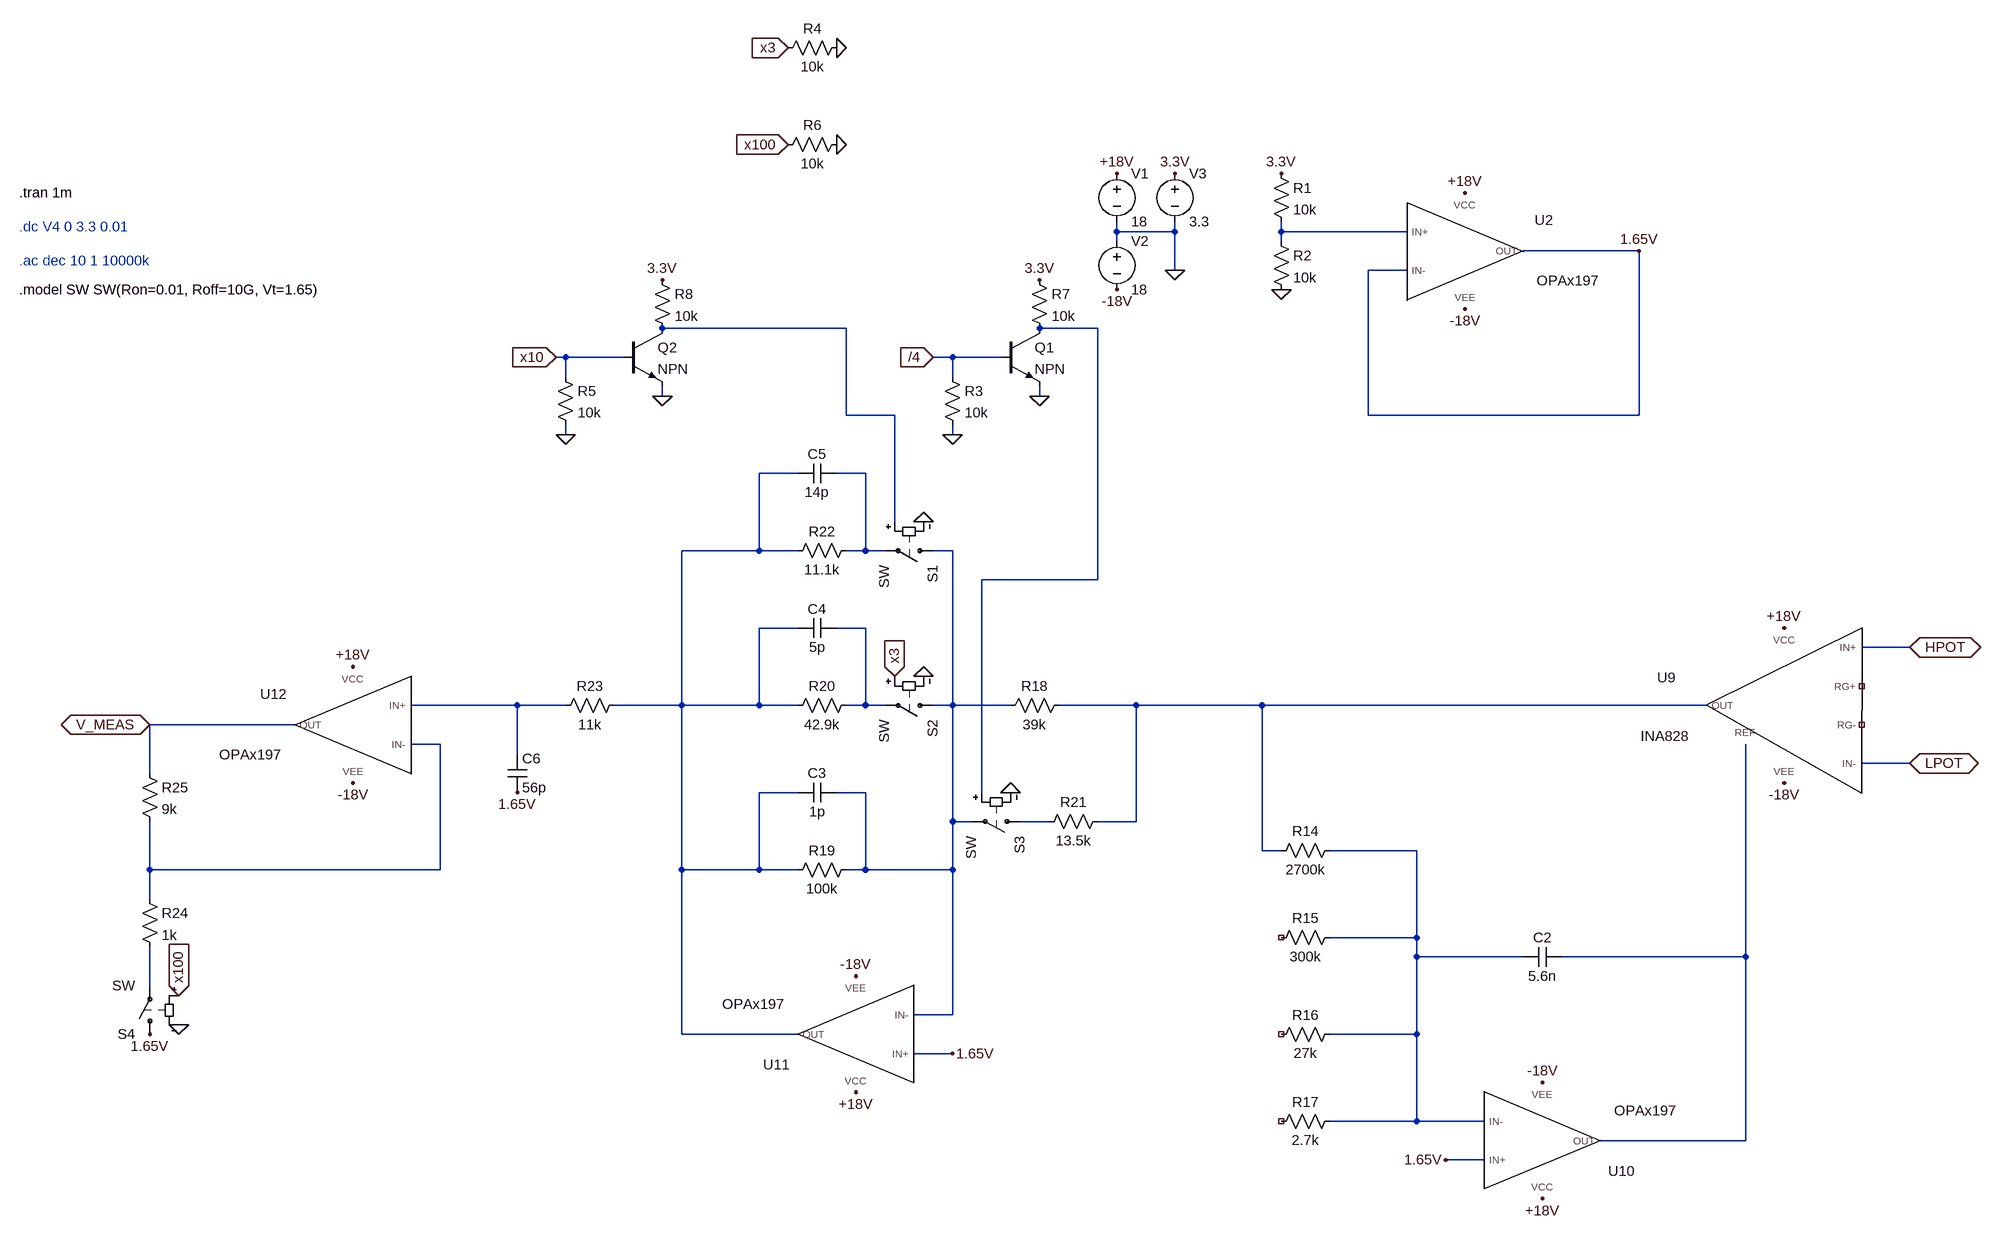
[diagram p0: schematic Vamp.asc]
Vamp.asc, the LTspice schematic file:
Version 4.1
SHEET 1 2076 5472
WIRE -16 1648 -16 1632
WIRE 80 1648 80 1632
WIRE 80 1648 -16 1648
WIRE 256 1648 256 1632
WIRE 464 1648 256 1648
WIRE -16 1664 -16 1648
WIRE 256 1664 256 1648
WIRE 848 1680 656 1680
WIRE 80 1712 80 1648
WIRE 464 1712 400 1712
WIRE -464 1808 -768 1808
WIRE -48 1808 -144 1808
WIRE -928 1856 -944 1856
WIRE -832 1856 -928 1856
WIRE -288 1856 -320 1856
WIRE -208 1856 -288 1856
WIRE -928 1888 -928 1856
WIRE -288 1888 -288 1856
WIRE -768 1920 -768 1904
WIRE -144 1920 -144 1904
WIRE -464 1952 -464 1808
WIRE -384 1952 -464 1952
WIRE 400 1952 400 1712
WIRE 848 1952 848 1680
WIRE 848 1952 400 1952
WIRE -928 1984 -928 1968
WIRE -288 1984 -288 1968
WIRE -544 2048 -608 2048
WIRE -432 2048 -480 2048
WIRE -384 2128 -384 1952
WIRE -608 2176 -608 2048
WIRE -608 2176 -736 2176
WIRE -544 2176 -608 2176
WIRE -432 2176 -432 2048
WIRE -432 2176 -464 2176
WIRE -400 2176 -432 2176
WIRE -288 2176 -320 2176
WIRE -48 2224 -48 1808
WIRE -48 2224 -240 2224
WIRE -544 2304 -608 2304
WIRE -432 2304 -480 2304
WIRE 1296 2336 1216 2336
WIRE -1008 2432 -1184 2432
WIRE -928 2432 -1008 2432
WIRE -736 2432 -736 2176
WIRE -736 2432 -848 2432
WIRE -608 2432 -608 2304
WIRE -608 2432 -736 2432
WIRE -544 2432 -608 2432
WIRE -432 2432 -432 2304
WIRE -432 2432 -464 2432
WIRE -400 2432 -432 2432
WIRE -288 2432 -288 2176
WIRE -288 2432 -320 2432
WIRE -192 2432 -288 2432
WIRE 16 2432 -112 2432
WIRE 224 2432 16 2432
WIRE 960 2432 224 2432
WIRE -1376 2464 -1616 2464
WIRE -1136 2496 -1184 2496
WIRE -1008 2512 -1008 2432
WIRE 1296 2528 1216 2528
WIRE -1616 2544 -1616 2464
WIRE -544 2576 -608 2576
WIRE -432 2576 -480 2576
WIRE -240 2576 -240 2224
WIRE -288 2624 -288 2432
WIRE -256 2624 -288 2624
WIRE -128 2624 -176 2624
WIRE 16 2624 16 2432
WIRE 16 2624 -48 2624
WIRE 224 2672 224 2432
WIRE 256 2672 224 2672
WIRE 480 2672 336 2672
WIRE -1616 2704 -1616 2624
WIRE -1136 2704 -1136 2496
WIRE -1136 2704 -1616 2704
WIRE -736 2704 -736 2432
WIRE -608 2704 -608 2576
WIRE -608 2704 -736 2704
WIRE -544 2704 -608 2704
WIRE -432 2704 -432 2576
WIRE -432 2704 -464 2704
WIRE -288 2704 -288 2624
WIRE -288 2704 -432 2704
WIRE -1616 2752 -1616 2704
WIRE 480 2816 480 2672
WIRE 480 2816 336 2816
WIRE 480 2848 480 2816
WIRE 656 2848 480 2848
WIRE 1024 2848 1024 2496
WIRE 1024 2848 720 2848
WIRE -1616 2896 -1616 2832
WIRE -288 2944 -288 2704
WIRE -288 2944 -352 2944
WIRE -736 2976 -736 2704
WIRE -544 2976 -736 2976
WIRE 480 2976 480 2848
WIRE 480 2976 336 2976
WIRE -288 3008 -352 3008
WIRE 480 3120 480 2976
WIRE 480 3120 336 3120
WIRE 592 3120 480 3120
WIRE 1024 3152 1024 2848
WIRE 1024 3152 784 3152
WIRE 592 3184 528 3184
FLAG 80 1712 0
FLAG -16 1552 +18V
FLAG -16 1744 -18V
FLAG 80 1552 3.3V
FLAG 560 1584 +18V
FLAG 560 1776 -18V
FLAG 256 1744 0
FLAG 256 1552 3.3V
FLAG 848 1680 1.65V
FLAG 1296 2336 HPOT
IOPIN 1296 2336 BiDir
FLAG 1296 2528 LPOT
IOPIN 1296 2528 BiDir
FLAG 688 3248 +18V
FLAG 688 3056 -18V
FLAG 528 3184 1.65V
FLAG 1088 2560 -18V
FLAG 1088 2304 +18V
FLAG -448 3072 +18V
FLAG -448 2880 -18V
FLAG -288 3008 1.65V
FLAG -1008 2576 1.65V
FLAG -1280 2368 +18V
FLAG -1280 2560 -18V
FLAG -1616 2464 V_MEAS
IOPIN -1616 2464 BiDir
FLAG -336 2128 0
FLAG -336 2384 0
FLAG -192 2576 0
FLAG -1616 2976 1.65V
FLAG -1568 2960 0
FLAG -1568 2912 x100
IOPIN -1568 2912 In
FLAG -384 2384 x3
IOPIN -384 2384 In
FLAG -944 1856 x10
IOPIN -944 1856 In
FLAG -560 1344 x3
IOPIN -560 1344 In
FLAG -560 1504 x100
IOPIN -560 1504 In
FLAG -320 1856 /4
IOPIN -320 1856 In
FLAG -288 1984 0
FLAG -480 1344 0
FLAG -928 1984 0
FLAG -480 1504 0
FLAG -144 1920 0
FLAG -144 1728 3.3V
FLAG -768 1920 0
FLAG -768 1728 3.3V
SYMBOL voltage -16 1536 R0
WINDOW 123 0 0 Left 0
WINDOW 39 0 0 Left 0
SYMATTR InstName V1
SYMATTR Value 18
SYMBOL voltage -16 1648 R0
WINDOW 123 0 0 Left 0
WINDOW 39 0 0 Left 0
SYMATTR InstName V2
SYMATTR Value 18
SYMBOL voltage 80 1536 R0
WINDOW 123 0 0 Left 0
WINDOW 39 0 0 Left 0
SYMATTR InstName V3
SYMATTR Value 3.3
SYMBOL lib\\sym\\OPAx197 560 1680 R0
SYMATTR InstName U2
SYMBOL res 240 1536 R0
SYMATTR InstName R1
SYMATTR Value 10k
SYMBOL res 240 1648 R0
SYMATTR InstName R2
SYMATTR Value 10k
SYMBOL lib\\sym\\INA828 1088 2432 M0
SYMATTR InstName U9
SYMBOL res 352 2656 R90
WINDOW 0 0 56 VBottom 2
WINDOW 3 32 56 VTop 2
SYMATTR InstName R14
SYMATTR Value 2700k
SYMBOL res 352 2800 R90
WINDOW 0 0 56 VBottom 2
WINDOW 3 32 56 VTop 2
SYMATTR InstName R15
SYMATTR Value 300k
SYMBOL res 352 2960 R90
WINDOW 0 0 56 VBottom 2
WINDOW 3 32 56 VTop 2
SYMATTR InstName R16
SYMATTR Value 27k
SYMBOL res 352 3104 R90
WINDOW 0 0 56 VBottom 2
WINDOW 3 32 56 VTop 2
SYMATTR InstName R17
SYMATTR Value 2.7k
SYMBOL lib\\sym\\OPAx197 688 3152 M180
SYMATTR InstName U10
SYMBOL cap 720 2832 R90
WINDOW 0 0 32 VBottom 2
WINDOW 3 32 32 VTop 2
SYMATTR InstName C2
SYMATTR Value 5.6n
SYMBOL res -96 2416 R90
WINDOW 0 0 56 VBottom 2
WINDOW 3 32 56 VTop 2
SYMATTR InstName R18
SYMATTR Value 39k
SYMBOL lib\\sym\\OPAx197 -448 2976 R180
SYMATTR InstName U11
SYMBOL res -448 2688 R90
WINDOW 0 0 56 VBottom 2
WINDOW 3 32 56 VTop 2
SYMATTR InstName R19
SYMATTR Value 100k
SYMBOL cap -480 2560 R90
WINDOW 0 0 32 VBottom 2
WINDOW 3 32 32 VTop 2
SYMATTR InstName C3
SYMATTR Value 1p
SYMBOL res -32 2608 R90
WINDOW 0 0 56 VBottom 2
WINDOW 3 32 56 VTop 2
SYMATTR InstName R21
SYMATTR Value 13.5k
SYMBOL res -448 2416 R90
WINDOW 0 0 56 VBottom 2
WINDOW 3 32 56 VTop 2
SYMATTR InstName R20
SYMATTR Value 42.9k
SYMBOL cap -480 2288 R90
WINDOW 0 0 32 VBottom 2
WINDOW 3 32 32 VTop 2
SYMATTR InstName C4
SYMATTR Value 5p
SYMBOL res -448 2160 R90
WINDOW 0 0 56 VBottom 2
WINDOW 3 32 56 VTop 2
SYMATTR InstName R22
SYMATTR Value 11.1k
SYMBOL cap -480 2032 R90
WINDOW 0 0 32 VBottom 2
WINDOW 3 32 32 VTop 2
SYMATTR InstName C5
SYMATTR Value 14p
SYMBOL res -832 2416 R90
WINDOW 0 0 56 VBottom 2
WINDOW 3 32 56 VTop 2
SYMATTR InstName R23
SYMATTR Value 11k
SYMBOL cap -1024 2512 R0
SYMATTR InstName C6
SYMATTR Value 56p
SYMBOL lib\\sym\\OPAx197 -1280 2464 M0
SYMATTR InstName U12
SYMBOL res -1632 2736 R0
SYMATTR InstName R24
SYMATTR Value 1k
SYMBOL res -1632 2528 R0
SYMATTR InstName R25
SYMATTR Value 9k
SYMBOL sw -304 2176 R90
SYMATTR InstName S1
SYMBOL sw -304 2432 R90
SYMATTR InstName S2
SYMBOL sw -160 2624 R90
SYMATTR InstName S3
SYMBOL sw -1616 2992 R180
SYMATTR InstName S4
SYMBOL res -304 1872 R0
SYMATTR InstName R3
SYMATTR Value 10k
SYMBOL res -464 1328 R90
WINDOW 0 0 56 VBottom 2
WINDOW 3 32 56 VTop 2
SYMATTR InstName R4
SYMATTR Value 10k
SYMBOL res -944 1872 R0
SYMATTR InstName R5
SYMATTR Value 10k
SYMBOL res -464 1488 R90
WINDOW 0 0 56 VBottom 2
WINDOW 3 32 56 VTop 2
SYMATTR InstName R6
SYMATTR Value 10k
SYMBOL npn -208 1808 R0
SYMATTR InstName Q1
SYMBOL res -160 1712 R0
SYMATTR InstName R7
SYMATTR Value 10k
SYMBOL npn -832 1808 R0
SYMATTR InstName Q2
SYMBOL res -784 1712 R0
SYMATTR InstName R8
SYMATTR Value 10k
TEXT -1832 1584 Left 2 !.tran 1m
TEXT -1832 1640 Left 2 ;.dc V4 0 3.3 0.01
TEXT -1832 1696 Left 2 ;.ac dec 10 1 10000k
TEXT -1832 1744 Left 2 !.model SW SW(Ron=0.01, Roff=10G, Vt=1.65)

The netlist it stands for:
* Vamp.asc
V1 +18V 0 18
V2 0 -18V 18
V3 3.3V 0 3.3
X§U2 N001 1.65V +18V -18V 1.65V OPAx197  ; pins IN+ IN- VCC VEE OUT
R1 3.3V N001 10k
R2 N001 0 10k
X§U9 HPOT LPOT +18V -18V N009 N013 NC_01 NC_02 INA828  ; pins IN+ IN- VCC VEE OUT REF RG+ RG-
R14 N012 N009 2700k
R15 N012 NC_03 300k
R16 N012 NC_04 27k
R17 N012 NC_05 2.7k
X§U10 1.65V N012 +18V -18V N013 OPAx197  ; pins IN+ IN- VCC VEE OUT
C2 N013 N012 5.6n
R18 N009 N006 39k
X§U11 1.65V N006 +18V -18V N004 OPAx197  ; pins IN+ IN- VCC VEE OUT
R19 N006 N004 100k
C3 N006 N004 1p
R21 N009 N011 13.5k
R20 N007 N004 42.9k
C4 N007 N004 5p
R22 N005 N004 11.1k
C5 N005 N004 14p
R23 N004 N008 11k
C6 N008 1.65V 56p
X§U12 N008 N010 +18V -18V V_MEAS OPAx197  ; pins IN+ IN- VCC VEE OUT
R24 N010 N014 1k
R25 V_MEAS N010 9k
S1 N006 N005 N002 0 SW
S2 N006 N007 x3 0 SW
S3 N011 N006 N003 0 SW
S4 1.65V N014 x100 0 SW
R3 /4 0 10k
R4 0 x3 10k
R5 x10 0 10k
R6 0 x100 10k
Q1 N003 /4 0 0 NPN
R7 3.3V N003 10k
Q2 N002 x10 0 0 NPN
R8 3.3V N002 10k
.model NPN NPN
.model PNP PNP
.lib standard.bjt
.tran 1m
* .dc V4 0 3.3 0.01
* .ac dec 10 1 10000k
.model SW SW(Ron=0.01, Roff=10G, Vt=1.65)
.lib OPAx197.LIB
.lib INA828.LIB
.backanno
.end